# EAGLE design ftdiBreakout (EAGLE 6.1)
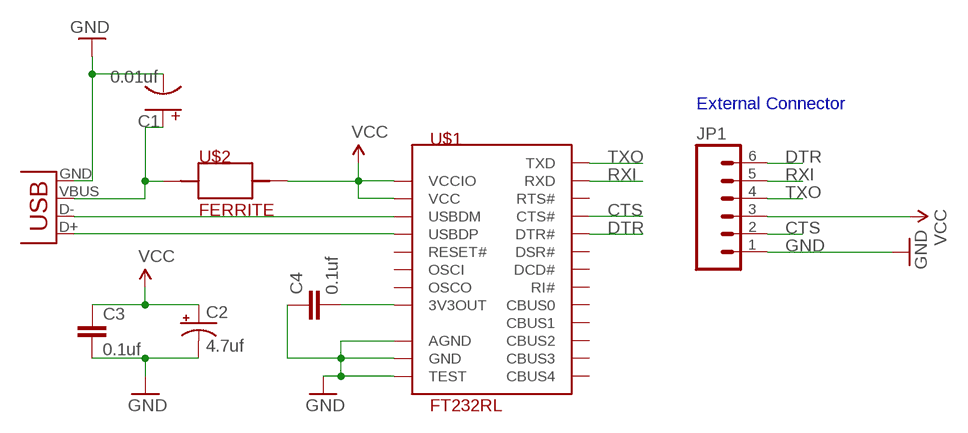
[diagram p0: schematic, sheet 1]

## Parts
C1  0.01uf  CAP_POL  [0805POL]
C2  4.7uf  CAP_POLPTH1  [CPOL-RADIAL-100UF-25V]
C3  0.1uf  CAP0805  [0805]
C4  0.1uf  CAP0805  [0805]
JP1  M06SIP  [1X06]
U$1  FT232RL  [TSSOP28]
U$2  FERRITE  [0805]
X1  USBSMD  [USB-MINIB]

## Nets
CTS: JP1.2 U$1.11(CTS#)
DTR: JP1.6 U$1.2(DTR#)
GND: C1.- C2.2(-) C3.2 C4.1 JP1.1 U$1.7(GND) U$1.18(GND) U$1.21(GND) U$1.25(AGND) U$1.26(TEST) X1.GND
N$1: C1.+ U$2.1 X1.VBUS
N$4: U$1.16(USBDM) X1.D-
N$5: U$1.15(USBDP) X1.D+
N$6: C4.2 U$1.17(3V3OUT)
RXI: JP1.5 U$1.5(RXD)
TXO: JP1.4 U$1.1(TXD)
VCC: C2.1(+) C3.1 JP1.3 U$1.4(VCCIO) U$1.20(VCC) U$2.2
Unconnected: U$1.3(RTS#) U$1.6(RI#) U$1.9(DSR#) U$1.10(DCD#) U$1.12(CBUS4) U$1.13(CBUS2) U$1.14(CBUS3) U$1.19(RESET#) U$1.22(CBUS1) U$1.23(CBUS0) U$1.27(OSCI) U$1.28(OSCO)

## Notes on the sheet
- External Connector

## Library data of the parts
C1 = Dustin:CAP_POL: Polarized Capacitor
C2 = SparkFun:CAP_POL: Capacitor Polarized These are standard SMD and PTH capacitors. Normally 10uF, 47uF, and 100uF in electrolytic and tantalum varieties. Always verify the external diameter of the through hole cap, it varies with capacity, voltage, and manufacturer. The EIA devices should be standard.
C3 C4 = SparkFun:CAP: Capacitor Standard 0603 ceramic capacitor, and 0.1" leaded capacitor.
JP1 = SparkFun:M06: Header 6 Standard 6-pin 0.1" header. Use with straight break away headers (SKU : PRT-00116), right angle break away headers (PRT-00553), swiss pins (PRT-00743), machine pins (PRT-00117), and female headers (PRT-00115). Molex polarized connector foot print use with SKU : PRT-08094 with associated crimp pins and housings. NOTES ON THE VARIANTS LOCK and LOCK_LONGPADS... This footprint was designed to help hold the alignment of a through-hole component (i.e. 6-pin header) while soldering it into place. You may notice that each hole has been shifted either up or down by 0.005 of an inch from it's more standard position (which is a perfectly straight line). This slight alteration caused the pins (the squares in the middle) to touch the edges of the holes. Because they are alternating, it causes a "brace" to hold the component in place. 0.005 has proven to be the perfect amount of "off-center" position when using our standard breakaway headers. Although looks a little odd when you look at the bare footprint, once you have a header in there, the alteration is very hard to notice. Also, if you push a header all the way into place, it is covered up entirely on the bottom side. This idea of altering the position of holes to aid alignment will be further integrated into the Sparkfun Library for other footprints. It can help hold any component with 3 or more connection pins.
U$1 = Dustin:FT232RL: FT232RL FTDI USB to serial UART interface Digikey 768-1007-1-ND
U$2 = Dustin:FERRITE
X1 = SparkFun:USB: USB Connectors USB-B-PTH is fully proven SKU : PRT-00139 USB-miniB is fully proven SKU : PRT-00587 USB-A-PCB is untested. USB-A-H is throughly reviewed, but untested. Spark Fun Electronics SKU : PRT-00437 USB-B-SMT is throughly reviewed, but untested. Needs silkscreen touching up. USB-A-S has not been used/tested USB-MB-H has not been used/tested

## Board
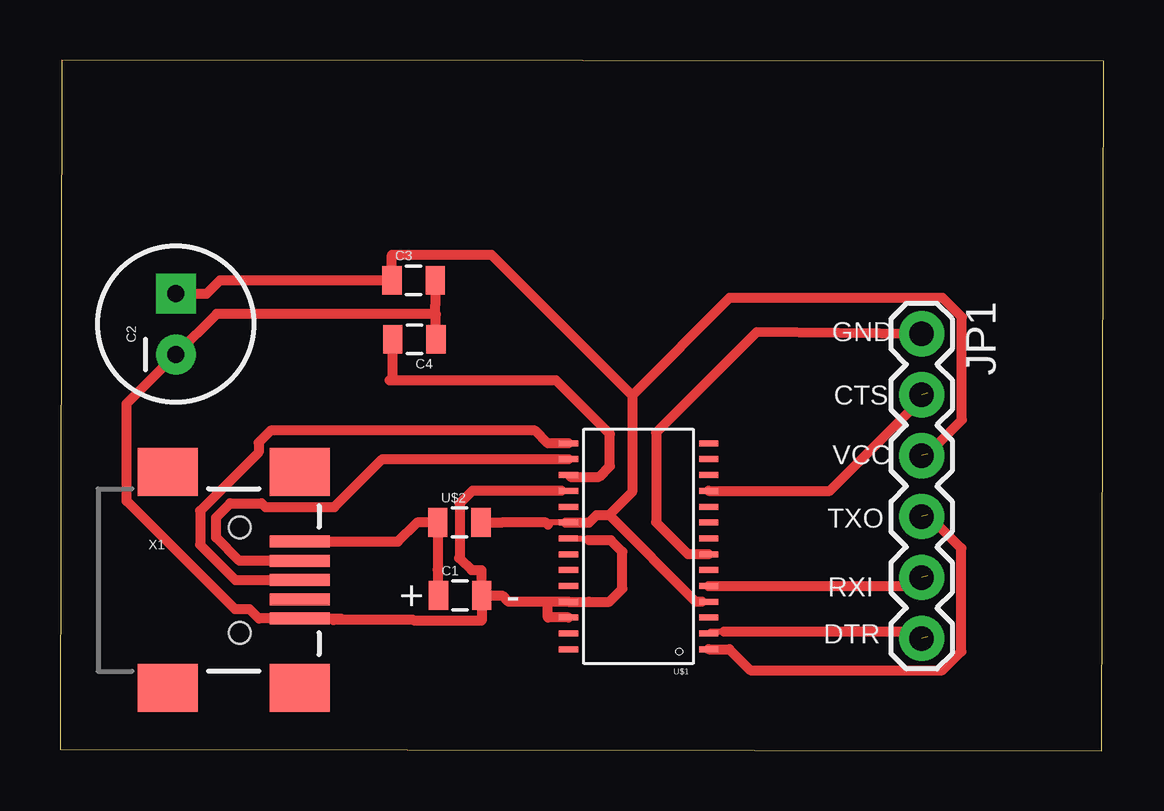
[diagram p1: board, top side]
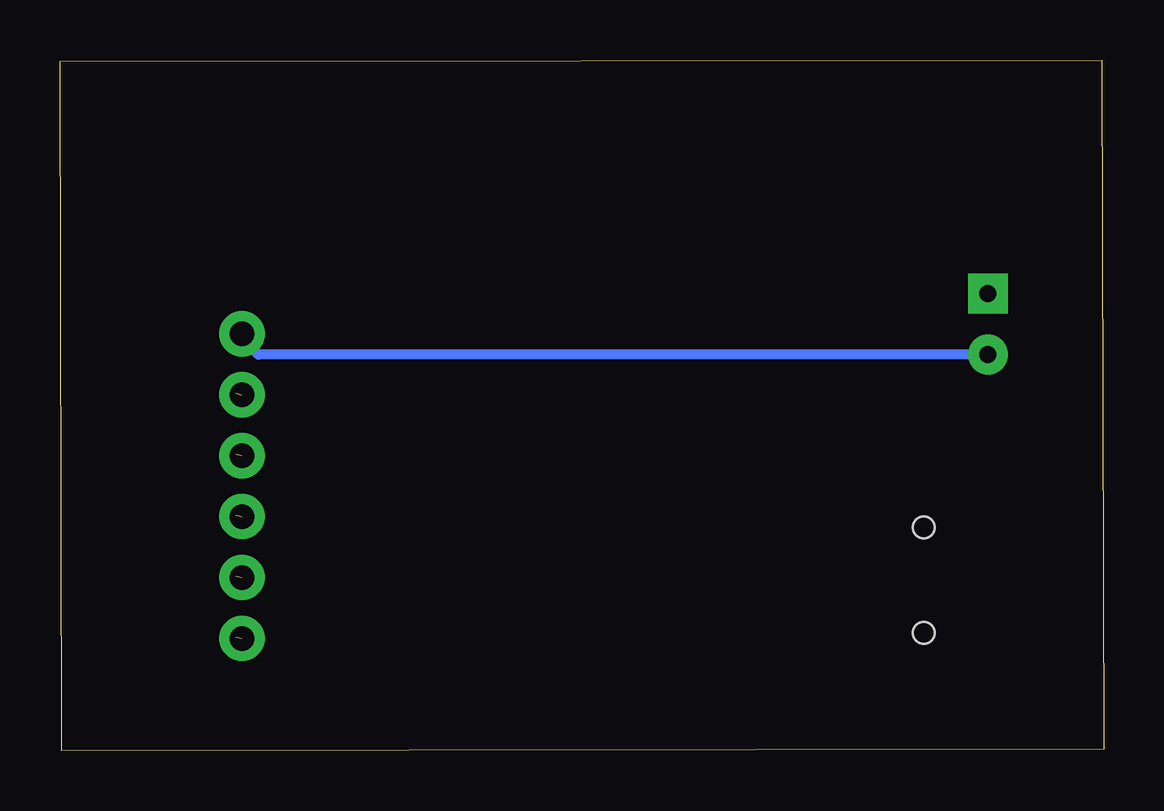
[diagram p2: board, bottom side, seen from below]

Size 43.48 x 28.79 mm. Coordinates in mm from the lower left corner, seen from the top.
Outline: 0,0.05 43.41,0 43.48,28.74 0.08,28.79 0,0.05
Copper layers (1*16): Top 0.0178mm / dielectric 59mil / Bottom 0.0178mm
Design rules: minimum track width 16mil, minimum drill 35mil, track to track 10mil, track to pad 10mil, pad to pad 10mil, via to via 30mil, smd to smd 6mil, copper to edge 20mil, drill to drill 16mil, minimum pad ring 8mil, minimum via ring 8mil, stop-mask expansion 3mil, vias tented up to drill 0mil, thermal gap 10mil

### Footprints (pad centres in the part's own frame; a part is rotated, then mirrored left to right if it is on the bottom)
0805POL = smd 0.8 x 1.2: + -0.9,0; - 0.9,0
CPOL-RADIAL-100UF-25V = drill 0.7 pad 1.651 square: 1 1.27,0 | drill 0.7 pad 1.651: 2 -1.27,0
0805 = smd 0.8 x 1.2: 1 -0.9,0; 2 0.9,0
1X06 = drill 1.016 pad 1.88: 1 0,0; 2 2.54,0; 3 5.08,0; 4 7.62,0; 5 10.16,0; 6 12.7,0
TSSOP28 = smd 0.8 x 0.25: 1 -2.921,4.623; 2 -2.921,3.962; 3 -2.921,3.302; 4 -2.921,2.642; 5 -2.921,1.981; 6 -2.921,1.321; 7 -2.921,0.66; 8 -2.927,0; 9 -2.921,-0.66; 10 -2.921,-1.321; 11 -2.921,-1.981; 12 -2.921,-2.642; 13 -2.921,-3.302; 14 -2.921,-3.962; 15 2.921,-3.962; 16 2.921,-3.302; 17 2.921,-2.642; 18 2.921,-1.981; 19 2.921,-1.321; 20 2.921,-0.66; 21 2.927,0; 22 2.921,0.66; 23 2.921,1.321; 24 2.921,1.981; 25 2.921,2.642; 26 2.921,3.302; 27 2.921,3.962; 28 2.921,4.623
USB-MINIB = smd 2.5 x 0.5: D+ 2.5,0; D- 2.5,0.8; GND 2.5,-1.6; ID 2.5,-0.8; VBUS 2.5,1.6 | smd 2.5 x 2: MTN1 -3,4.5; MTN2 2.5,4.5; MTN3 -3,-4.5; MTN4 2.5,-4.5 | hole 0.9: 0,2.2; 0,-2.2

### Placement (x,y rotation side)
C1  16.67,6.47 0 top
C2  4.83,17.78 90 top
C3  14.73,19.6 0 top
C4  14.76,17.15 180 top
JP1  35.9,17.37 270 top
U$1  24.11,8.85 180 top
U$2  16.64,9.51 0 top
X1  7.49,7.11 0 top

### Tracks (layer width: path | path; a pad name or v marks a point on that pad's centre or on a via)
CTS  (1 unrouted)
  Top 0.406: U$1.11 32.08,10.83 36.16,14.91
DTR  (1 unrouted)
  Top 0.25: U$1.2 27.11,4.96 27.66,4.96
  Top 0.406: 27.66,4.96 35.94,4.96 36.16,4.75
GND
  Top 0.25: 22.05,8.77 22.04,8.77 21.96,8.85 U$1.21 | 20.89,10.83 U$1.18
  Top 0.406: 22.05,8.77 22.95,8.77 23.43,8.28 23.43,6.74 22.9,6.21 22.05,6.21 U$1.25 20.5,6.21 20.33,6.21 | C4.1 15.66,18.18 15.63,18.21 | 15.63,18.21 15.63,18.55 C3.2 | 15.63,18.21 6.52,18.21 C2.2 2.78,14.47 2.78,10.41 7.29,5.9 7.9,5.9 8.29,5.51 X1.GND 10.85,5.51 11.7,5.51 | 16.65,8.02 17.15,7.52 17.57,7.52 C1.- | 20.89,10.83 17.18,10.83 16.65,10.3 16.65,8.02 | 16.65,8.02 16.62,8.02 | 11.36,5.47 11.39,5.45 14.73,5.45 14.77,5.41 17.57,5.41 C1.- | 11.36,5.47 | 11.36,5.47 11.66,5.47 11.7,5.51 | 11.7,5.51 | JP1.1 29.03,17.45 24.84,13.26 24.84,9.52 26.17,8.19 U$1.7 | C1.- 18.42,6.47 18.69,6.21 20.33,6.21 | U$1.26 20.33,5.55 20.33,6.21
  Bottom 0.406: C2.2 35.22,16.51 JP1.1
N$1
  Top 0.406: C1.+ 15.77,7.52 15.74,7.55 U$2.1 14.88,9.51 14.08,8.71 X1.VBUS
N$4
  Top 0.25: U$1.16
  Top 0.406: X1.D- 7.47,7.91 6.5,8.89 6.5,9.72 7.09,10.31 8.4,10.31 8.55,10.15 11.43,10.15 13.43,12.15 U$1.16
N$5
  Top 0.406: X1.D+ 7.31,7.11 5.84,8.58 5.84,10 8.28,12.44 8.28,12.84 8.78,13.34 19.8,13.34 20.33,12.81 U$1.15
N$6
  Top 0.25: U$1.17 21.27,11.41
  Top 0.406: 13.88,15.43 13.86,15.45 C4.2 | 13.88,15.43 13.85,15.43 13.82,15.43 13.77,15.43 13.75,15.43 13.72,15.43 | 21.27,11.41 22.46,11.41 22.91,11.87 22.91,13.19 20.67,15.43 13.88,15.43
RXI  (1 unrouted)
  Top 0.406: U$1.5 35.73,6.87 36.16,7.29
TXO  (1 unrouted)
  Top 0.406: 36.16,9.83 37.56,8.43 37.56,4.14 36.77,3.35 28.76,3.35 27.89,4.22 U$1.1
VCC  (1 unrouted)
  Top 0.25: 20.33,9.43 20.41,9.51 21.05,9.51 | U$1.4 26.75,6.21
  Top 0.406: 20.33,9.43 20.25,9.51 18.4,9.51 U$2.2 | 23.84,14.81 17.98,20.66 13.83,20.66 C3.1 6.66,19.6 6.11,19.05 C2.1 | 36.16,12.37 37.57,13.78 37.57,18.07 36.78,18.87 27.89,18.87 23.84,14.81 | 23.84,14.81 23.84,10.78 22.88,9.82 | 22.88,9.82 22.36,9.82 22.05,9.51 U$1.20 21.05,9.51 | 26.75,6.21 26.5,6.21 22.88,9.82

### Text on the board
tNames: GND | CTS | VCC | TXO | RXI | DTR